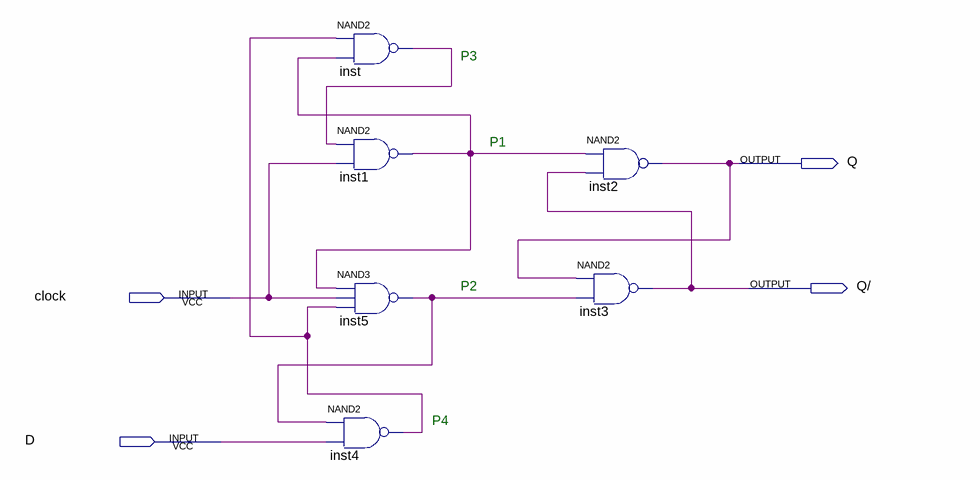
[diagram p0: schematic sheet]
// Quartus schematic flipflopDsubida.bdf as structural Verilog: 6 symbols, 4 pins
module flipflopDsubida (
  input  clock,
  input  D,
  output Q,
  output \Q/ 
);

  wire inst1_out, inst4_out, inst5_out, inst_out;

  nand inst (inst_out, inst4_out, inst1_out);
  nand inst1 (inst1_out, inst_out, clock);
  nand inst5 (inst5_out, inst1_out, clock, inst4_out);
  nand inst4 (inst4_out, inst5_out, D);
  nand inst2 (Q, inst1_out, \Q/ );
  nand inst3 (\Q/ , Q, inst5_out);

  // Notes on the sheet:
  //   P3
  //   P1
  //   P2
  //   P4
endmodule
